# EAGLE board bms_108_Cell (EAGLE 6.2), part 1 of 6
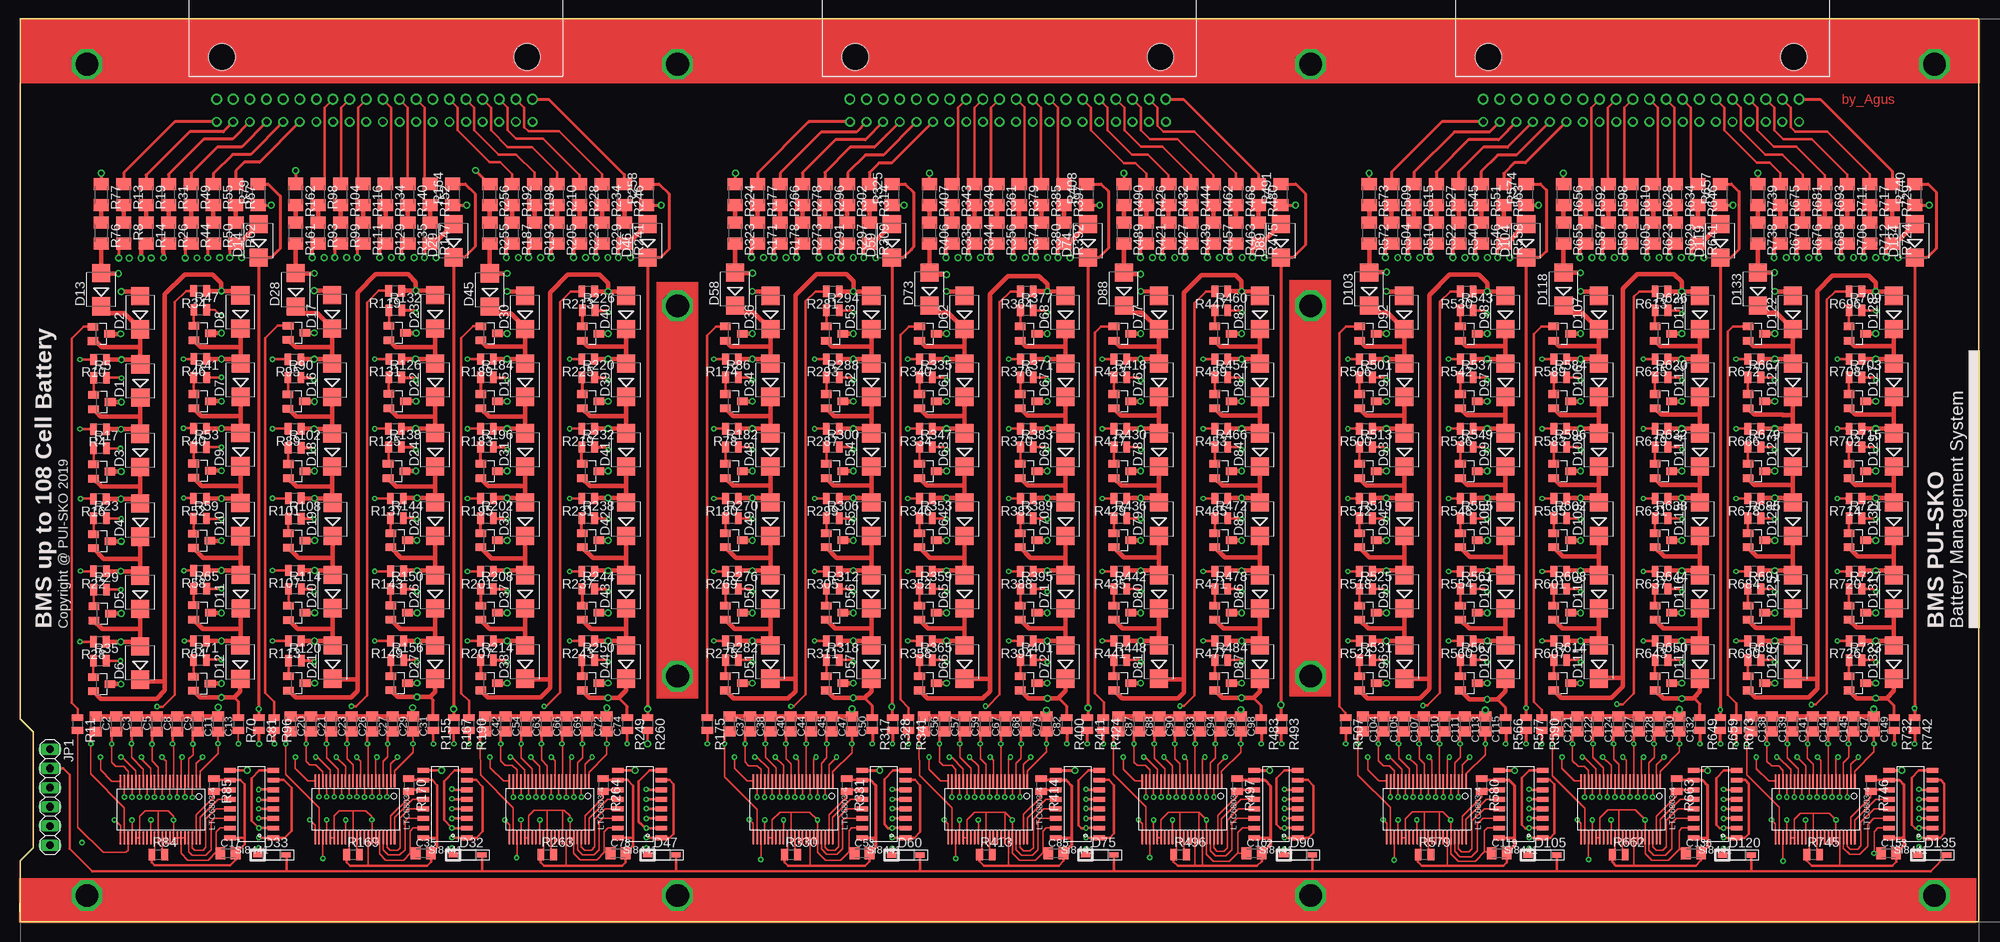
[diagram p9: board, top side]
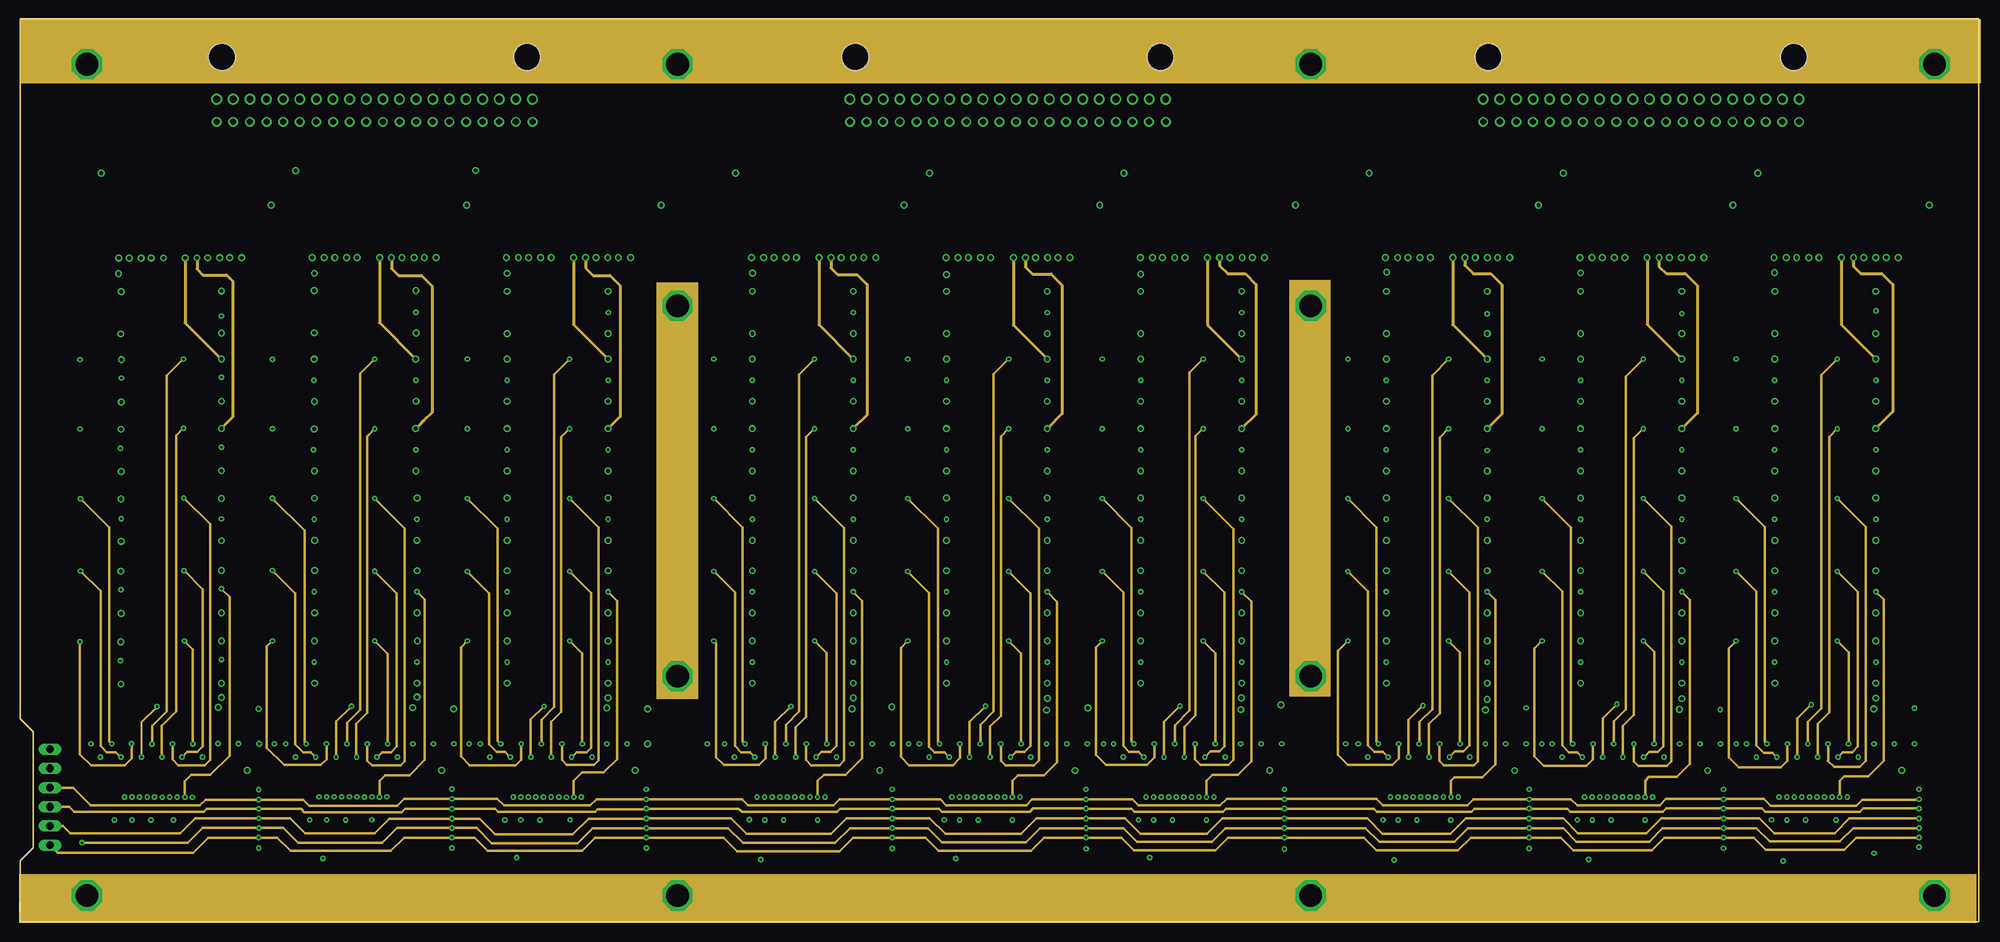
[diagram p10: board, inner layer Route3]
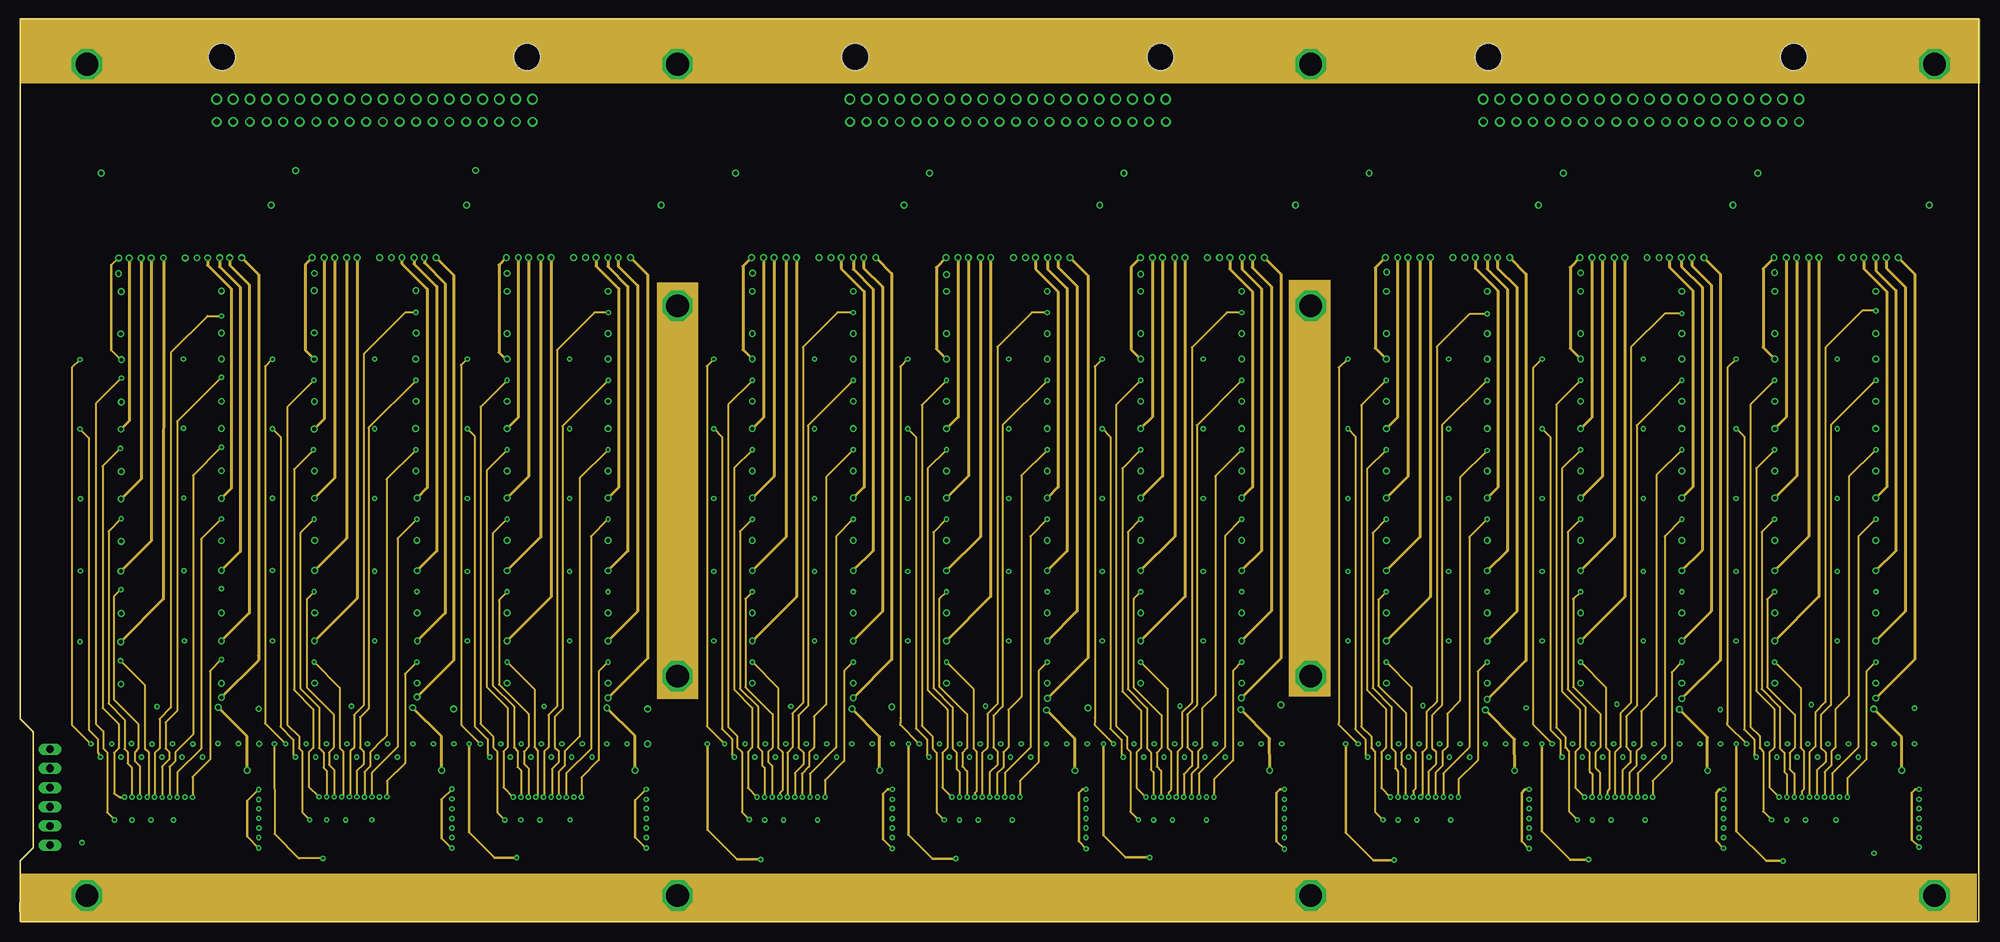
[diagram p11: board, inner layer Route21]
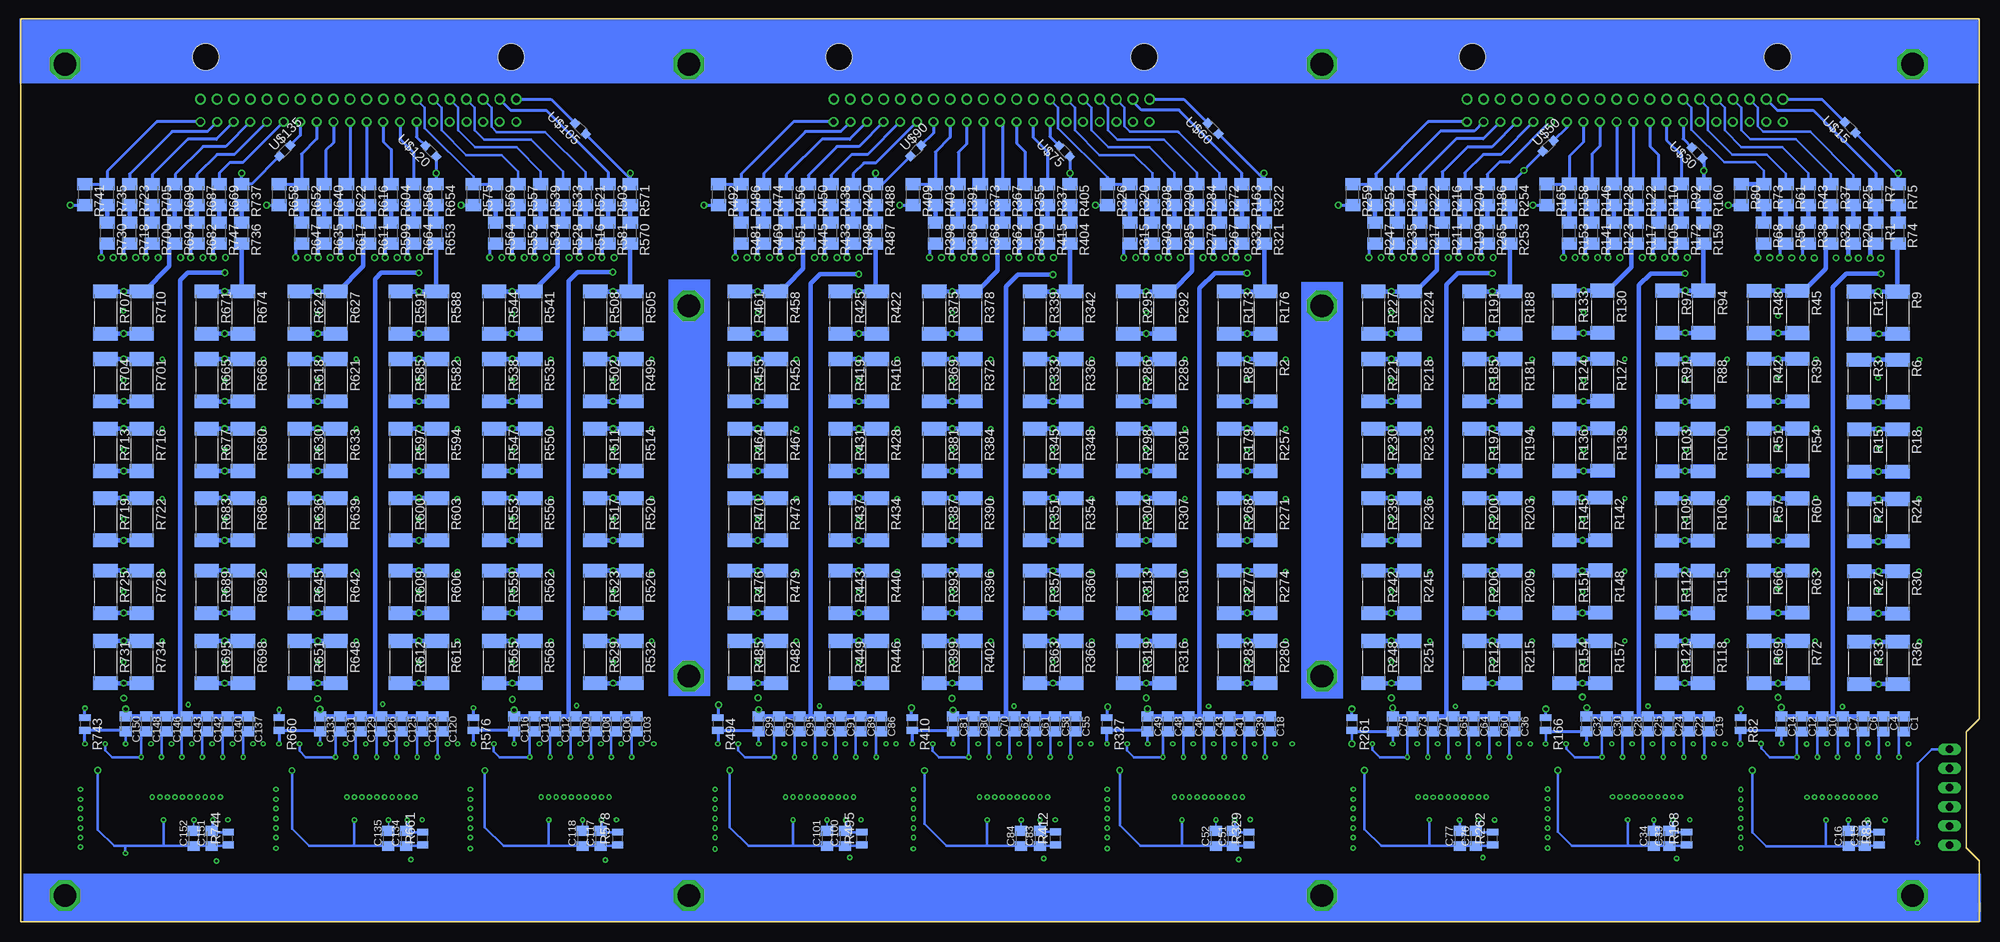
[diagram p12: board, bottom side, seen from below]

Size 259.21 x 119.5 mm. Coordinates in mm from the lower left corner, seen from the top.
Outline: 0,2.5 0.02,0
Outline: 0.02,0 259.21,0 259.21,119.5 0.02,119.5
Outline: 0.02,119.5 0.02,119.5
Outline: 0.02,0 0.02,8.03 1.78,9.79 1.78,25.1 0.02,26.86 0.02,119.5
Copper layers (1*16): Top 0.035mm / dielectric 1.5mm / Bottom 0.035mm
Design rules: minimum track width 10mil, minimum drill 24mil, track to track 8mil, track to pad 8mil, pad to pad 8mil, via to via 8mil, smd to smd 8mil, copper to edge 40mil, drill to drill 8mil, minimum pad ring 10mil, minimum via ring 8mil, stop-mask expansion 4mil, vias tented up to drill 0mil, thermal gap 10mil

## Footprints (pad centres in the part's own frame; a part is rotated, then mirrored left to right if it is on the bottom)
C0805K = smd 1.3 x 1.6: 1 -1,0; 2 1,0
SMB = smd 2.4 x 2.4: A 2.2,0; C -2.2,0
SOD123 = smd 1.2 x 0.7: A 1.9,0; C -1.9,0
1X06 = drill 1.016 long: 1 -6.35,0; 2 -3.81,0; 3 -1.27,0; 4 1.27,0; 5 3.81,0; 6 6.35,0
M1206 = smd 1.6 x 2: 1 -1.4,0; 2 1.4,0
R6332 = smd 1.8 x 3.2: 1 -2.8,0; 2 2.8,0
R0805 = smd 0.889 x 1.5: 1 -0.85,0; 2 0.85,0
40PIN = drill 0.9: 1 -20.847,-6.125; 3 -18.647,-6.125; 5 -16.447,-6.125; 7 -14.247,-6.125; 9 -12.047,-6.125; 11 -9.847,-6.125; 13 -7.647,-6.125; 15 -5.447,-6.125; 17 -3.247,-6.125; 19 -1.047,-6.125; 21 1.153,-6.125; 23 3.353,-6.125; 25 5.553,-6.125; 27 7.753,-6.125; 29 9.953,-6.125; 31 12.153,-6.125; 33 14.353,-6.125; 35 16.553,-6.125; 37 18.753,-6.125; 39 20.953,-6.125 | drill 0.8: 2 -20.846,-9.126; 4 -18.646,-9.126; 6 -16.446,-9.126; 8 -14.246,-9.126; 10 -12.046,-9.126; 12 -9.846,-9.126; 14 -7.646,-9.126; 16 -5.446,-9.126; 18 -3.246,-9.126; 20 -1.046,-9.126; 22 1.154,-9.126; 24 3.354,-9.126; 26 5.554,-9.126; 28 7.754,-9.126; 30 9.954,-9.126; 32 12.154,-9.126; 34 14.354,-9.126; 36 16.554,-9.126; 38 18.754,-9.126; 40 20.954,-9.126 | hole 3.5: -20.147,-0.525; 20.253,-0.525
SSOP44 = smd 1.75 x 0.2: 23 3.619,-5.787; 24 3.619,-5.287; 25 3.619,-4.787; 26 3.619,-4.287; 27 3.619,-3.787; 28 3.619,-3.287; 29 3.619,-2.787; 30 3.619,-2.287; 31 3.619,-1.787; 32 3.619,-1.287; 33 3.619,-0.787; 34 3.619,-0.287; 35 3.619,0.213; 36 3.619,0.713; 37 3.619,1.213; 38 3.619,1.713; 39 3.619,2.213; 40 3.619,2.713; 41 3.619,3.213; 42 3.619,3.713; 43 3.619,4.213; 44 3.619,4.713; P$1 -3.881,4.713; P$2 -3.881,4.213; P$3 -3.881,3.713; P$4 -3.881,3.213; P$5 -3.881,2.713; P$6 -3.881,2.213; P$7 -3.881,1.713; P$8 -3.881,1.213; P$9 -3.881,0.713; P$10 -3.881,0.213; P$11 -3.881,-0.287; P$12 -3.881,-0.787; P$13 -3.881,-1.287; P$14 -3.881,-1.787; P$15 -3.881,-2.287; P$16 -3.881,-2.787; P$17 -3.881,-3.287; P$18 -3.881,-3.787; P$19 -3.881,-4.287; P$20 -3.881,-4.787; P$21 -3.881,-5.287; P$22 -3.881,-5.787
SO16 = smd 1.524 x 0.65: 1 -2.875,4.445; 2 -2.875,3.175; 3 -2.875,1.905; 4 -2.875,0.635; 5 -2.875,-0.635; 6 -2.875,-1.905; 7 -2.875,-3.175; 8 -2.875,-4.445; 9 2.875,-4.445; 10 2.875,-3.175; 11 2.875,-1.905; 12 2.875,-0.635; 13 2.875,0.635; 14 2.875,1.905; 15 2.875,3.175; 16 2.875,4.445
SOT23 = smd 1 x 1.4: 1 -0.95,-1.1; 2 0.95,-1.1; 3 0,1.1
L2012C = smd 1 x 1: 1 -1,0; 2 1,0